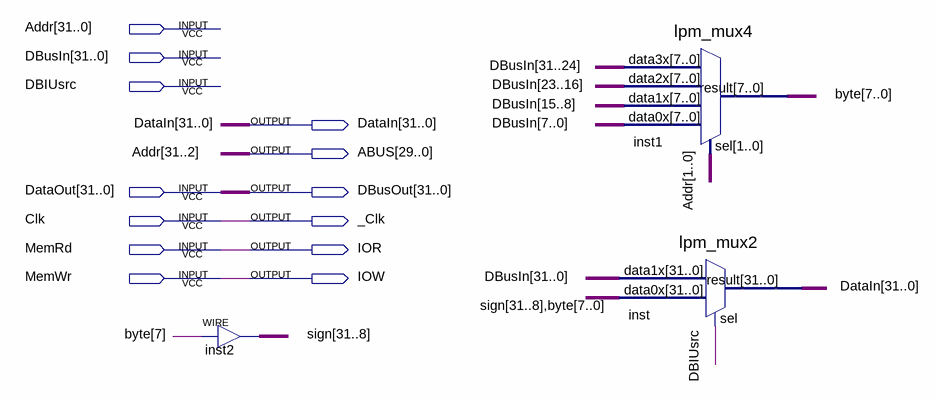
[diagram p0: schematic sheet]
// Quartus schematic DBIU.bdf as structural Verilog: 3 symbols, 13 pins
module DBIU (
  input  [31:0] Addr,
  input  [31:0] DBusIn,
  input  DBIUsrc,
  input  [31:0] DataOut,
  input  Clk,
  input  MemRd,
  input  MemWr,
  output [31:0] DataIn,
  output [29:0] ABUS,
  output [31:0] DBusOut,
  output _Clk,
  output IOR,
  output IOW
);

  wire [7:0] \byte ;
  wire [31:8] sign;

  assign sign = {24{\byte [7]}};  // WIRE inst2
  lpm_mux4 inst1 (
    .data3x(DBusIn[31:24]), .data2x(DBusIn[23:16]), .data1x(DBusIn[15:8]), .data0x(DBusIn[7:0]),
    .sel(Addr[1:0]), .result(\byte ));
  lpm_mux2 inst (.data1x(DBusIn), .data0x({sign, \byte }), .sel(DBIUsrc), .result(DataIn));

  assign _Clk = Clk;
  assign ABUS = Addr[31:2];
  assign DBusOut = DataOut;
  assign IOR = MemRd;
  assign IOW = MemWr;
endmodule
